# EAGLE design I2C shifter (EAGLE 7.6.0)
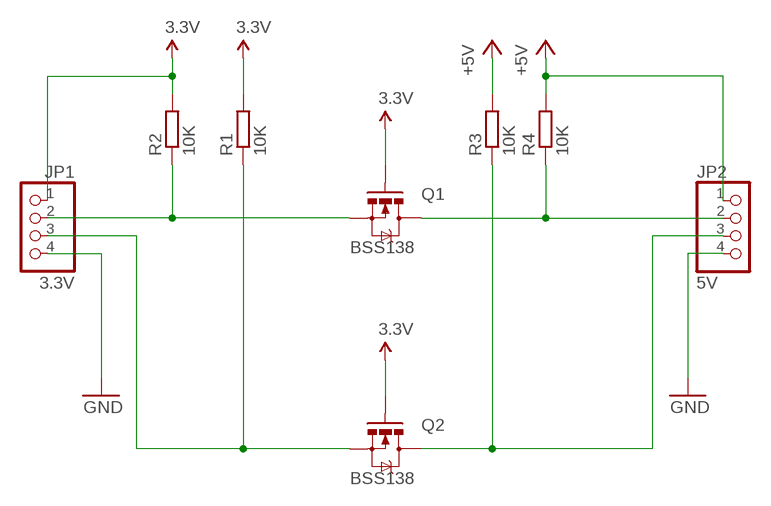
[diagram p0: schematic, sheet 1]

## Parts
JP1  3.3V  PINHD-1X4  [1X04]
JP2  5V  PINHD-1X4  [1X04]
Q1  BSS138  MOSFET-NCHANNELBSS138  [SOT23-3]
Q2  BSS138  MOSFET-NCHANNELBSS138  [SOT23-3]
R1  10K  R-EU_M1206  [M1206]
R2  10K  R-EU_M1206  [M1206]
R3  10K  R-EU_M1206  [M1206]
R4  10K  R-EU_M1206  [M1206]

## Nets
3.3V: JP1.1 Q1.1(G) Q2.1(G) R1.2 R2.2
+5V: JP2.1 R3.2 R4.2
GND: JP1.4 JP2.4
N$1: JP1.2 Q1.2(S) R2.1
N$2: JP1.3 Q2.2(S) R1.1
N$3: JP2.2 Q1.3(D) R4.1
N$4: JP2.3 Q2.3(D) R3.1

## Library data of the parts
JP1 JP2 = pinhead:PINHD-1X4: PIN HEADER
Q1 Q2 = SparkFun-DiscreteSemi:MOSFET-NCHANNEL: Common NMOSFET Parts MFG P/N Store ID Prod ID FDD8780 TRANS-09984 SI7820DN TRANS-11055 FDS6630A IC-08089 2N7002PW TRANS-11151 FQP30N06L COM-10213 TRANS-10060 BSS123LT1G TRANS-08345 BSS138 TRANS-00830 BS170 2N7000; PROD_ID: TRANS-00830; VALUE: 200mA/50V
R1-R4 = rcl:R-EU_: RESISTOR, European symbol

## Board
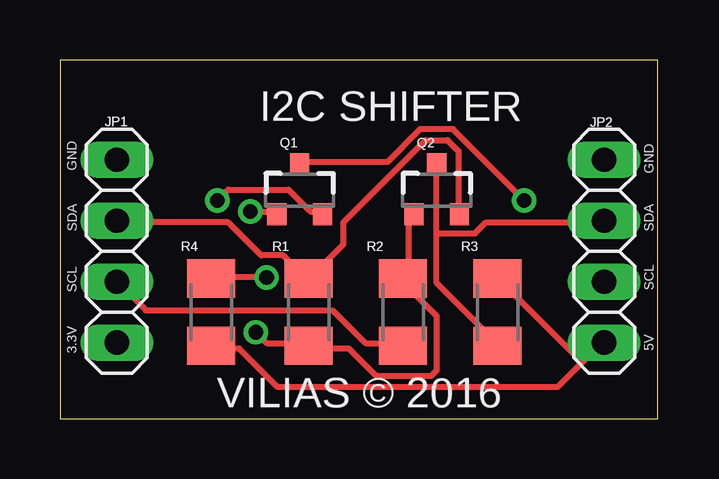
[diagram p1: board, top side]
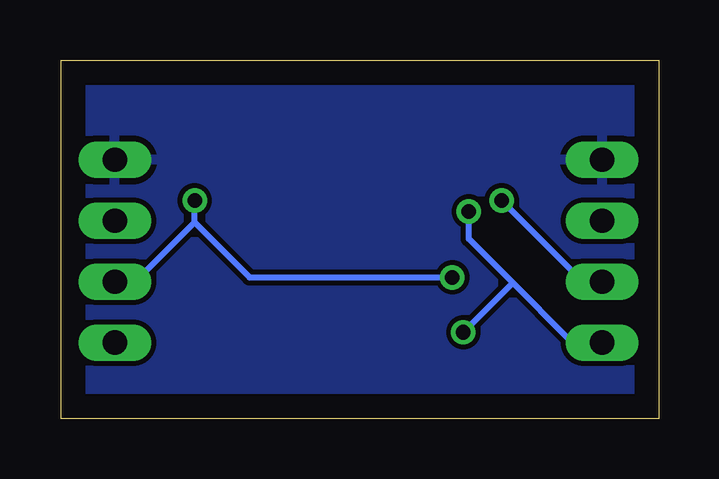
[diagram p2: board, bottom side, seen from below]

Size 24.93 x 14.95 mm. Coordinates in mm from the lower left corner, seen from the top.
Outline: 0,0 24.93,0 24.93,14.95 0,14.95 0,0
Copper layers (1*16): Top 0.035mm / dielectric 1.5mm / Bottom 0.035mm
Design rules "default": minimum track width 10mil, minimum drill 24mil, track to track 8mil, track to pad 8mil, pad to pad 8mil, via to via 8mil, smd to smd 8mil, copper to edge 40mil, drill to drill 8mil, minimum pad ring 10mil, minimum via ring 8mil, stop-mask expansion 4mil, vias tented up to drill 0mil, thermal gap 10mil

### Footprints (pad centres in the part's own frame; a part is rotated, then mirrored left to right if it is on the bottom)
1X04 = drill 1.016 long: 1 -3.81,0; 2 -1.27,0; 3 1.27,0; 4 3.81,0
SOT23-3 = smd 0.8 x 0.9: 1 -0.95,-1; 2 0.95,-1; 3 0,1.1
M1206 = smd 1.6 x 2: 1 -1.4,0; 2 1.4,0

### Placement (x,y rotation side)
JP1  2.37,6.98 90 top
JP2  22.69,6.98 90 top
Q1  9.99,9.53 0 top
Q2  15.71,9.53 0 top
R1  10.37,4.44 270 top
R2  14.31,4.44 90 top
R3  18.25,4.44 90 top
R4  6.31,4.44 270 top

### Tracks (layer width: path | path; a pad name or v marks a point on that pad's centre or on a via)
3.3V  (via drill 0.61)
  Top 0.254: Q2.1 14.56,8.41 14.56,6.13 14.33,5.9 R2.2 14.33,5.67 15.7,4.3 15.7,2.01 15.47,1.78 13.19,1.78 12.05,2.93 10.45,2.93 R1.2 10.22,3.15 8.62,3.15 v8.16,3.61 | v7.93,8.64 8.84,8.64 Q1.1
  Bottom 0.254: v7.93,8.64 7.93,7.5 6.1,5.67 | 6.1,5.67 3.82,3.38 2.44,3.38 JP1.1 | 6.1,5.67 v8.16,3.61
+5V
  Top 0.254: 21.88,2.47 22.56,3.15 JP2.1 21.88,2.47 | 21.88,2.47 20.73,1.33 9.07,1.33 7.47,2.93 6.33,2.93 R4.2 | 21.88,2.47 21.65,2.47 18.45,5.67 R3.2
GND
  pour Bottom: -0.07,15.19 25.33,15.19 25.33,-0.05 -0.07,-0.05
N$1  (via drill 0.61)
  Top 0.254: v6.56,9.1 7.02,9.55 9.53,9.55 10.45,8.64 10.9,8.64 Q1.2 | R2.1 14.1,3.15 12.73,3.15 11.36,4.53 3.59,4.53 2.44,5.67 JP1.2
  Bottom 0.254: v6.56,9.1 3.36,5.9 2.44,5.9 JP1.2
N$2
  Top 0.254: Q2.2 16.62,8.64 16.62,11.15 16.16,11.61 15.25,11.61 11.82,8.18 11.82,7.27 10.45,5.9 R1.1 10.22,5.9 9.3,6.81 8.39,6.81 7.02,8.18 2.44,8.18 JP1.3
N$3  (via drill 0.61)
  Top 0.254: v19.36,9.1 16.39,12.07 15.02,12.07 13.65,10.7 10.22,10.7 Q1.3 | v8.62,5.9 6.33,5.9 R4.1
  Bottom 0.254: 19.36,8.18 v19.36,9.1 | 19.36,8.18 21.65,5.9 22.56,5.9 JP2.2 | v8.62,5.9 17.07,5.9 19.36,8.18
N$4
  Top 0.254: 15.7,7.73 15.7,5.67 18.22,3.15 R3.1 | 15.7,7.73 15.7,10.47 Q2.3 | 15.7,7.73 17.3,7.73 17.76,8.18 22.56,8.18 JP2.3

### Text on the board
tNames: I2C SHIFTER | GND | GND | SDA | SDA | SCL | SCL | 3.3V | 5V | VILIAS © 2016
_tNames: JP1 | JP2 | Q1 | Q2 | R4 | R1 | R2 | R3